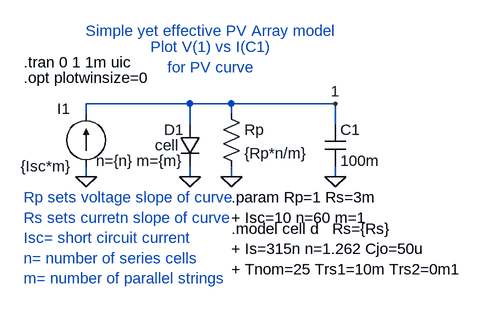
[diagram p0: schematic PV.asc]
PV.asc, the LTspice schematic file:
Version 4
SHEET 1 880 680
WIRE 272 32 112 32
WIRE 336 32 272 32
WIRE 496 32 336 32
WIRE 112 48 112 32
WIRE 336 48 336 32
WIRE 272 64 272 32
WIRE 496 64 496 32
WIRE 112 144 112 128
WIRE 272 144 272 128
WIRE 336 144 336 128
WIRE 496 144 496 128
FLAG 272 144 0
FLAG 112 144 0
FLAG 336 144 0
FLAG 496 144 0
FLAG 496 32 1
SYMBOL current 112 128 R180
WINDOW 0 24 88 Left 0
WINDOW 3 24 0 Left 0
WINDOW 123 0 0 Left 0
WINDOW 39 0 0 Left 0
SYMATTR InstName I1
SYMATTR Value {Isc*m}
SYMBOL diode 288 64 M0
WINDOW 0 25 8 Left 0
WINDOW 3 34 32 Left 0
WINDOW 123 25 56 Left 0
SYMATTR InstName D1
SYMATTR Value cell
SYMATTR Value2 n={n} m={m}
SYMBOL res 320 32 R0
SYMATTR InstName Rp
SYMATTR Value {Rp*n/m}
SYMBOL cap 480 64 R0
SYMATTR InstName C1
SYMATTR Value 100m
TEXT 336 224 Left 0 !.model cell d   Rs={Rs}\n+ Is=315n n=1.262 Cjo=50u\n+ Tnom=25 Trs1=10m Trs2=0m1
TEXT 304 -80 Center 0 ;Simple yet effective PV Array model
TEXT 16 176 Left 0 ;Rp sets voltage slope of curve\nRs sets curretn slope of curve\nIsc= short circuit current\nn= number of series cells\nm= number of parallel strings
TEXT 336 176 Left 0 !.param Rp=1 Rs=3m\n+ Isc=10 n=60 m=1
TEXT 16 -32 Left 0 !.tran 0 1 1m uic
TEXT 304 -40 Center 0 ;Plot V(1) vs I(C1)\nfor PV curve
TEXT 16 -8 Left 0 !.opt plotwinsize=0

The netlist it stands for:
* PV.asc
I1 0 1 {Isc*m}
D1 1 0 cell n={n} m={m}
Rp 1 0 {Rp*n/m}
C1 1 0 100m
.model D D
.lib standard.dio
.model cell d   Rs={Rs}
+ Is=315n n=1.262 Cjo=50u
+ Tnom=25 Trs1=10m Trs2=0m1
* Simple yet effective PV Array model
* Rp sets voltage slope of curve
* Rs sets curretn slope of curve
* Isc= short circuit current
* n= number of series cells
* m= number of parallel strings
.param Rp=1 Rs=3m
+ Isc=10 n=60 m=1
.tran 0 1 1m uic
* Plot V(1) vs I(C1)
* for PV curve
.opt plotwinsize=0
.backanno
.end